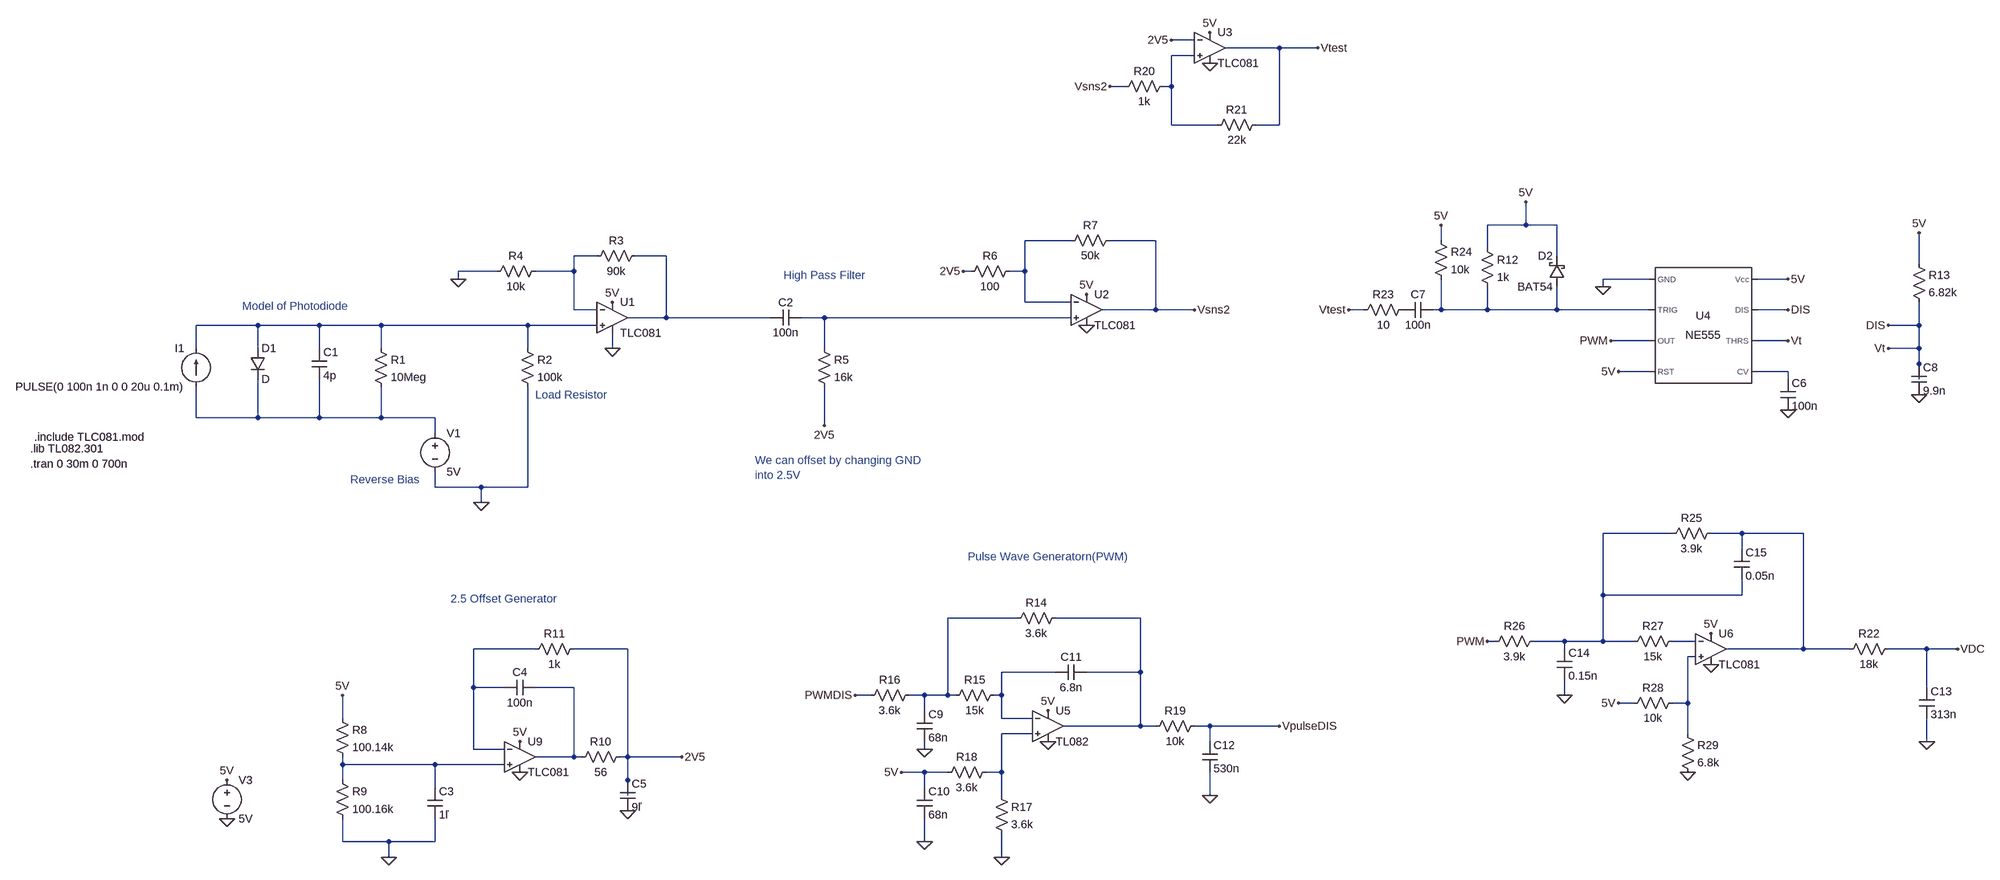
[diagram p0: schematic Receiver_2.asc]
Receiver_2.asc, the LTspice schematic file:
Version 4
SHEET 1 5060 1348
WIRE 2240 -432 2192 -432
WIRE 2416 -416 2304 -416
WIRE 2496 -416 2416 -416
WIRE 2240 -400 2192 -400
WIRE 2096 -336 2064 -336
WIRE 2192 -336 2192 -400
WIRE 2192 -336 2176 -336
WIRE 2192 -256 2192 -336
WIRE 2288 -256 2192 -256
WIRE 2416 -256 2416 -416
WIRE 2416 -256 2368 -256
WIRE 2928 -48 2928 -96
WIRE 2928 -48 2848 -48
WIRE 2992 -48 2928 -48
WIRE 1984 -16 1888 -16
WIRE 2160 -16 2064 -16
WIRE 2752 -16 2752 -48
WIRE 2848 0 2848 -48
WIRE 960 16 912 16
WIRE 1104 16 1040 16
WIRE 2992 16 2992 -48
WIRE 3744 32 3744 -32
WIRE 752 48 672 48
WIRE 912 48 912 16
WIRE 912 48 832 48
WIRE 1776 48 1760 48
WIRE 1888 48 1888 -16
WIRE 1888 48 1856 48
WIRE 672 64 672 48
WIRE 3184 64 3088 64
WIRE 3472 64 3408 64
WIRE 3088 80 3088 64
WIRE 1888 112 1888 48
WIRE 1984 112 1888 112
WIRE 912 128 912 48
WIRE 960 128 912 128
WIRE 2160 128 2160 -16
WIRE 2160 128 2048 128
WIRE 2240 128 2160 128
WIRE 2592 128 2560 128
WIRE 2752 128 2752 64
WIRE 2752 128 2736 128
WIRE 2848 128 2848 80
WIRE 2848 128 2752 128
WIRE 2992 128 2992 80
WIRE 2992 128 2848 128
WIRE 3184 128 2992 128
WIRE 3472 128 3408 128
WIRE 1104 144 1104 16
WIRE 1104 144 1024 144
WIRE 1360 144 1104 144
WIRE 1472 144 1424 144
WIRE 1984 144 1472 144
WIRE 256 160 128 160
WIRE 384 160 256 160
WIRE 512 160 384 160
WIRE 816 160 512 160
WIRE 960 160 816 160
WIRE 3744 160 3744 112
WIRE 3744 160 3680 160
WIRE 3184 192 3104 192
WIRE 3472 192 3408 192
WIRE 128 208 128 160
WIRE 256 208 256 160
WIRE 384 208 384 160
WIRE 512 208 512 160
WIRE 816 208 816 160
WIRE 992 208 992 176
WIRE 1472 208 1472 144
WIRE 3744 208 3744 160
WIRE 3744 208 3680 208
WIRE 3744 240 3744 208
WIRE 3184 256 3120 256
WIRE 3472 256 3408 256
WIRE 3472 272 3472 256
WIRE 3744 272 3744 240
WIRE 128 352 128 288
WIRE 256 352 256 272
WIRE 256 352 128 352
WIRE 384 352 384 272
WIRE 384 352 256 352
WIRE 512 352 512 288
WIRE 512 352 384 352
WIRE 624 352 512 352
WIRE 1472 368 1472 288
WIRE 624 384 624 352
WIRE 624 496 624 464
WIRE 720 496 624 496
WIRE 816 496 816 288
WIRE 816 496 720 496
WIRE 720 528 720 496
WIRE 3232 592 3088 592
WIRE 3376 592 3312 592
WIRE 3504 592 3376 592
WIRE 3376 624 3376 592
WIRE 3088 720 3088 592
WIRE 3376 720 3376 688
WIRE 3376 720 3088 720
WIRE 1872 768 1728 768
WIRE 2128 768 1952 768
WIRE 2864 816 2848 816
WIRE 3008 816 2944 816
WIRE 3088 816 3088 720
WIRE 3088 816 3008 816
WIRE 3152 816 3088 816
WIRE 3280 816 3232 816
WIRE 832 832 704 832
WIRE 1024 832 912 832
WIRE 3008 832 3008 816
WIRE 3504 832 3504 592
WIRE 3504 832 3344 832
WIRE 3600 832 3504 832
WIRE 3760 832 3680 832
WIRE 3824 832 3760 832
WIRE 3280 848 3264 848
WIRE 1952 880 1840 880
WIRE 2128 880 2128 768
WIRE 2128 880 2016 880
WIRE 704 912 704 832
WIRE 768 912 704 912
WIRE 912 912 832 912
WIRE 3760 912 3760 832
WIRE 1568 928 1536 928
WIRE 1680 928 1648 928
WIRE 1728 928 1728 768
WIRE 1728 928 1680 928
WIRE 1744 928 1728 928
WIRE 1840 928 1840 880
WIRE 1840 928 1824 928
WIRE 3008 928 3008 896
WIRE 3152 944 3120 944
WIRE 3264 944 3264 848
WIRE 3264 944 3232 944
WIRE 1680 960 1680 928
WIRE 432 976 432 928
WIRE 1840 976 1840 928
WIRE 1904 976 1840 976
WIRE 2128 992 2128 880
WIRE 2128 992 1968 992
WIRE 2160 992 2128 992
WIRE 2272 992 2240 992
WIRE 2416 992 2272 992
WIRE 1904 1008 1840 1008
WIRE 3264 1008 3264 944
WIRE 2272 1024 2272 992
WIRE 3760 1024 3760 976
WIRE 704 1040 704 912
WIRE 768 1040 704 1040
WIRE 1680 1040 1680 1024
WIRE 912 1056 912 912
WIRE 912 1056 832 1056
WIRE 928 1056 912 1056
WIRE 1024 1056 1024 832
WIRE 1024 1056 1008 1056
WIRE 1136 1056 1024 1056
WIRE 432 1072 432 1056
WIRE 624 1072 432 1072
WIRE 768 1072 624 1072
WIRE 1680 1088 1632 1088
WIRE 1728 1088 1680 1088
WIRE 1840 1088 1840 1008
WIRE 1840 1088 1808 1088
WIRE 432 1104 432 1072
WIRE 1024 1104 1024 1056
WIRE 624 1120 624 1072
WIRE 1680 1120 1680 1088
WIRE 1024 1136 1024 1104
WIRE 1840 1136 1840 1088
WIRE 2272 1136 2272 1088
WIRE 432 1232 432 1184
WIRE 528 1232 432 1232
WIRE 624 1232 624 1184
WIRE 624 1232 528 1232
WIRE 1680 1232 1680 1184
WIRE 528 1264 528 1232
WIRE 1840 1264 1840 1216
FLAG 720 528 0
FLAG 992 208 0
FLAG 672 64 0
FLAG 1760 48 2V5
FLAG 2240 128 Vsns2
FLAG 192 1184 0
FLAG 192 1104 5V
FLAG 432 928 5V
FLAG 528 1264 0
FLAG 1024 1168 0
FLAG 1136 1056 2V5
FLAG 3088 80 0
FLAG 3472 336 0
FLAG 3472 192 Vt
FLAG 3472 128 DIS
FLAG 3472 64 5V
FLAG 2928 -96 5V
FLAG 3120 256 5V
FLAG 3104 192 PWM
FLAG 3744 304 0
FLAG 3680 160 DIS
FLAG 3680 208 Vt
FLAG 3744 -32 5V
FLAG 1840 1264 0
FLAG 1680 1040 0
FLAG 1680 1232 0
FLAG 1632 1088 5V
FLAG 1536 928 PWMDIS
FLAG 2272 1136 0
FLAG 2416 992 VpulseDIS
FLAG 1472 368 2V5
FLAG 2064 -336 Vsns2
FLAG 2192 -432 2V5
FLAG 2496 -416 Vtest
FLAG 992 112 5V
FLAG 2016 96 5V
FLAG 2016 160 0
FLAG 2272 -384 0
FLAG 2272 -448 5V
FLAG 800 1088 0
FLAG 800 1024 5V
FLAG 1936 1024 0
FLAG 1936 960 5V
FLAG 3760 1024 0
FLAG 3824 832 VDC
FLAG 2560 128 Vtest
FLAG 2752 -48 5V
FLAG 3312 800 5V
FLAG 3312 864 0
FLAG 2848 816 PWM
FLAG 3008 928 0
FLAG 3120 944 5V
FLAG 3264 1088 0
SYMBOL current 128 288 R180
WINDOW 0 24 80 Left 2
WINDOW 3 24 0 Left 2
WINDOW 123 0 0 Left 0
WINDOW 39 0 0 Left 0
SYMATTR InstName I1
SYMATTR Value PULSE(0 100n 1n 0 0 20u 0.1m)
SYMBOL diode 240 208 R0
SYMATTR InstName D1
SYMBOL cap 368 208 R0
SYMATTR InstName C1
SYMATTR Value 4p
SYMBOL res 496 192 R0
SYMATTR InstName R1
SYMATTR Value 10Meg
SYMBOL voltage 624 368 R0
WINDOW 123 0 0 Left 0
WINDOW 39 0 0 Left 0
SYMATTR InstName V1
SYMATTR Value 5V
SYMBOL res 800 192 R0
SYMATTR InstName R2
SYMATTR Value 100k
SYMBOL res 1056 0 R90
WINDOW 0 0 56 VBottom 2
WINDOW 3 32 56 VTop 2
SYMATTR InstName R3
SYMATTR Value 90k
SYMBOL res 848 32 R90
WINDOW 0 0 56 VBottom 2
WINDOW 3 32 56 VTop 2
SYMATTR InstName R4
SYMATTR Value 10k
SYMBOL cap 1424 128 R90
WINDOW 0 0 32 VBottom 2
WINDOW 3 32 32 VTop 2
SYMATTR InstName C2
SYMATTR Value 100n
SYMBOL res 1456 192 R0
SYMATTR InstName R5
SYMATTR Value 16k
SYMBOL res 1872 32 R90
WINDOW 0 0 56 VBottom 2
WINDOW 3 32 56 VTop 2
SYMATTR InstName R6
SYMATTR Value 100
SYMBOL res 2080 -32 R90
WINDOW 0 0 56 VBottom 2
WINDOW 3 32 56 VTop 2
SYMATTR InstName R7
SYMATTR Value 50k
SYMBOL voltage 192 1088 R0
SYMATTR InstName V3
SYMATTR Value 5V
SYMBOL res 416 960 R0
SYMATTR InstName R8
SYMATTR Value 100.14k
SYMBOL res 416 1088 R0
SYMATTR InstName R9
SYMATTR Value 100.16k
SYMBOL cap 608 1120 R0
SYMATTR InstName C3
SYMATTR Value 1ľ
SYMBOL cap 832 896 R90
WINDOW 0 0 32 VBottom 2
WINDOW 3 32 32 VTop 2
SYMATTR InstName C4
SYMATTR Value 100n
SYMBOL res 1024 1040 R90
WINDOW 0 0 56 VBottom 2
WINDOW 3 32 56 VTop 2
SYMATTR InstName R10
SYMATTR Value 56
SYMBOL res 928 816 R90
WINDOW 0 0 56 VBottom 2
WINDOW 3 32 56 VTop 2
SYMATTR InstName R11
SYMATTR Value 1k
SYMBOL cap 1008 1104 R0
SYMATTR InstName C5
SYMATTR Value 9ľ
SYMBOL NE555 3296 160 R0
SYMATTR InstName U4
SYMBOL cap 3456 272 R0
SYMATTR InstName C6
SYMATTR Value 100n
SYMBOL schottky 3008 80 R180
WINDOW 0 24 64 Left 2
WINDOW 3 24 0 Left 2
SYMATTR InstName D2
SYMATTR Value BAT54
SYMBOL res 2832 -16 R0
SYMATTR InstName R12
SYMATTR Value 1k
SYMBOL cap 2736 112 R90
WINDOW 0 0 32 VBottom 2
WINDOW 3 32 32 VTop 2
SYMATTR InstName C7
SYMATTR Value 100n
SYMBOL res 3728 16 R0
SYMATTR InstName R13
SYMATTR Value 6.82k
SYMBOL cap 3728 240 R0
SYMATTR InstName C8
SYMATTR Value 9.9n
SYMBOL res 1968 752 R90
WINDOW 0 0 56 VBottom 2
WINDOW 3 32 56 VTop 2
SYMATTR InstName R14
SYMATTR Value 3.6k
SYMBOL res 1840 912 R90
WINDOW 0 0 56 VBottom 2
WINDOW 3 32 56 VTop 2
SYMATTR InstName R15
SYMATTR Value 15k
SYMBOL res 1664 912 R90
WINDOW 0 0 56 VBottom 2
WINDOW 3 32 56 VTop 2
SYMATTR InstName R16
SYMATTR Value 3.6k
SYMBOL cap 1664 960 R0
SYMATTR InstName C9
SYMATTR Value 68n
SYMBOL res 1824 1120 R0
SYMATTR InstName R17
SYMATTR Value 3.6k
SYMBOL res 1824 1072 R90
WINDOW 0 0 56 VBottom 2
WINDOW 3 32 56 VTop 2
SYMATTR InstName R18
SYMATTR Value 3.6k
SYMBOL cap 1664 1120 R0
SYMATTR InstName C10
SYMATTR Value 68n
SYMBOL cap 2016 864 R90
WINDOW 0 0 32 VBottom 2
WINDOW 3 32 32 VTop 2
SYMATTR InstName C11
SYMATTR Value 6.8n
SYMBOL cap 2256 1024 R0
SYMATTR InstName C12
SYMATTR Value 530n
SYMBOL res 2256 976 R90
WINDOW 0 0 56 VBottom 2
WINDOW 3 32 56 VTop 2
SYMATTR InstName R19
SYMATTR Value 10k
SYMBOL res 2192 -352 R90
WINDOW 0 0 56 VBottom 2
WINDOW 3 32 56 VTop 2
SYMATTR InstName R20
SYMATTR Value 1k
SYMBOL res 2384 -272 R90
WINDOW 0 0 56 VBottom 2
WINDOW 3 32 56 VTop 2
SYMATTR InstName R21
SYMATTR Value 22k
SYMBOL opamp2 992 80 R0
SYMATTR InstName U1
SYMATTR Value TLC081
SYMBOL opamp2 2016 64 R0
SYMATTR InstName U2
SYMATTR Value TLC081
SYMBOL opamp2 800 992 R0
SYMATTR InstName U9
SYMATTR Value TLC081
SYMBOL opamp2 1936 928 R0
SYMATTR InstName U5
SYMATTR Value TL082
SYMBOL opamp2 2272 -480 R0
SYMATTR InstName U3
SYMATTR Value TLC081
SYMBOL Res 3696 816 R90
WINDOW 0 0 56 VBottom 2
WINDOW 3 32 56 VTop 2
SYMATTR InstName R22
SYMATTR Value 18k
SYMBOL Cap 3744 912 R0
SYMATTR InstName C13
SYMATTR Value 313n
SYMBOL Res 2688 112 R90
WINDOW 0 0 56 VBottom 2
WINDOW 3 32 56 VTop 2
SYMATTR InstName R23
SYMATTR Value 10
SYMBOL Res 2736 -32 R0
SYMATTR InstName R24
SYMATTR Value 10k
SYMBOL opamp2 3312 768 R0
SYMATTR InstName U6
SYMATTR Value TLC081
SYMBOL res 3328 576 R90
WINDOW 0 0 56 VBottom 2
WINDOW 3 32 56 VTop 2
SYMATTR InstName R25
SYMATTR Value 3.9k
SYMBOL res 2960 800 R90
WINDOW 0 0 56 VBottom 2
WINDOW 3 32 56 VTop 2
SYMATTR InstName R26
SYMATTR Value 3.9k
SYMBOL res 3248 800 R90
WINDOW 0 0 56 VBottom 2
WINDOW 3 32 56 VTop 2
SYMATTR InstName R27
SYMATTR Value 15k
SYMBOL cap 2992 832 R0
SYMATTR InstName C14
SYMATTR Value 0.15n
SYMBOL cap 3360 624 R0
SYMATTR InstName C15
SYMATTR Value 0.05n
SYMBOL res 3248 928 R90
WINDOW 0 0 56 VBottom 2
WINDOW 3 32 56 VTop 2
SYMATTR InstName R28
SYMATTR Value 10k
SYMBOL res 3248 992 R0
SYMATTR InstName R29
SYMATTR Value 6.8k
TEXT 832 304 Left 2 ;Load Resistor
TEXT -216 448 Left 2 !.tran 0 30m 0 700n
TEXT 224 120 Left 2 ;Model of Photodiode
TEXT 448 480 Left 2 ;Reverse Bias
TEXT 1472 56 Center 2 ;High Pass Filter
TEXT 1328 440 Left 2 ;We can offset by changing GND\ninto 2.5V
TEXT 1936 640 Center 2 ;Pulse Wave Generatorn(PWM)
TEXT 656 728 Left 2 ;2.5 Offset Generator
TEXT -216 416 Left 2 !.lib TL082.301
TEXT -208 392 Left 2 !.include TLC081.mod

The netlist it stands for:
* Receiver_2.asc
I1 N009 N007 PULSE(0 100n 1n 0 0 20u 0.1m)
D1 N007 N009 D
C1 N007 N009 4p
R1 N007 N009 10Meg
V1 N009 0 5V
R2 N007 0 100k
R3 N004 N003 90k
R4 N003 0 10k
C2 N006 N004 100n
R5 N006 2V5 16k
R6 N002 2V5 100
R7 Vsns2 N002 50k
V3 5V 0 5V
R8 5V N020 100.14k
R9 N020 0 100.16k
C3 N020 0 1ľ
C4 N018 N015 100n
R10 2V5 N018 56
R11 2V5 N015 1k
C5 2V5 0 9ľ
XU4 0 N005 PWM 5V N008 DIS DIS 5V NE555  ; pins GND TRIG OUT RST CV THRS DIS Vcc
C6 N008 0 100n
D2 N005 5V BAT54
R12 5V N005 1k
C7 N005 P001 100n
R13 5V DIS 6.82k
C8 DIS 0 9.9n
R14 N013 N012 3.6k
R15 N017 N012 15k
R16 N012 PWMDIS 3.6k
C9 N012 0 68n
R17 N019 0 3.6k
R18 N019 5V 3.6k
C10 5V 0 68n
C11 N013 N017 6.8n
C12 VpulseDIS 0 530n
R19 VpulseDIS N013 10k
R20 N001 Vsns2 1k
R21 Vtest N001 22k
XU1 N007 N003 5V 0 N004 TLC081  ; pins In+ In- V+ V- OUT
XU2 N006 N002 5V 0 Vsns2 TLC081  ; pins In+ In- V+ V- OUT
XU9 N020 N015 5V 0 N018 TLC081  ; pins In+ In- V+ V- OUT
XU5 N019 N017 5V 0 N013 TL082  ; pins In+ In- V+ V- OUT
XU3 N001 2V5 5V 0 Vtest TLC081  ; pins In+ In- V+ V- OUT
R22 VDC N011 18k
C13 VDC 0 313n
R23 P001 Vtest 10
R24 5V N005 10k
XU6 N016 N014 5V 0 N011 TLC081  ; pins In+ In- V+ V- OUT
R25 N011 N010 3.9k
R26 N010 PWM 3.9k
R27 N014 N010 15k
C14 N010 0 0.15n
C15 N011 N010 0.05n
R28 N016 5V 10k
R29 N016 0 6.8k
.model D D
.lib standard.dio
* Load Resistor
.tran 0 30m 0 700n
* Model of Photodiode
* Reverse Bias
* High Pass Filter
* We can offset by changing GND
* into 2.5V
* Pulse Wave Generatorn(PWM)
* 2.5 Offset Generator
.lib TL082.301
.include TLC081.mod
.lib NE555.sub
.backanno
.end